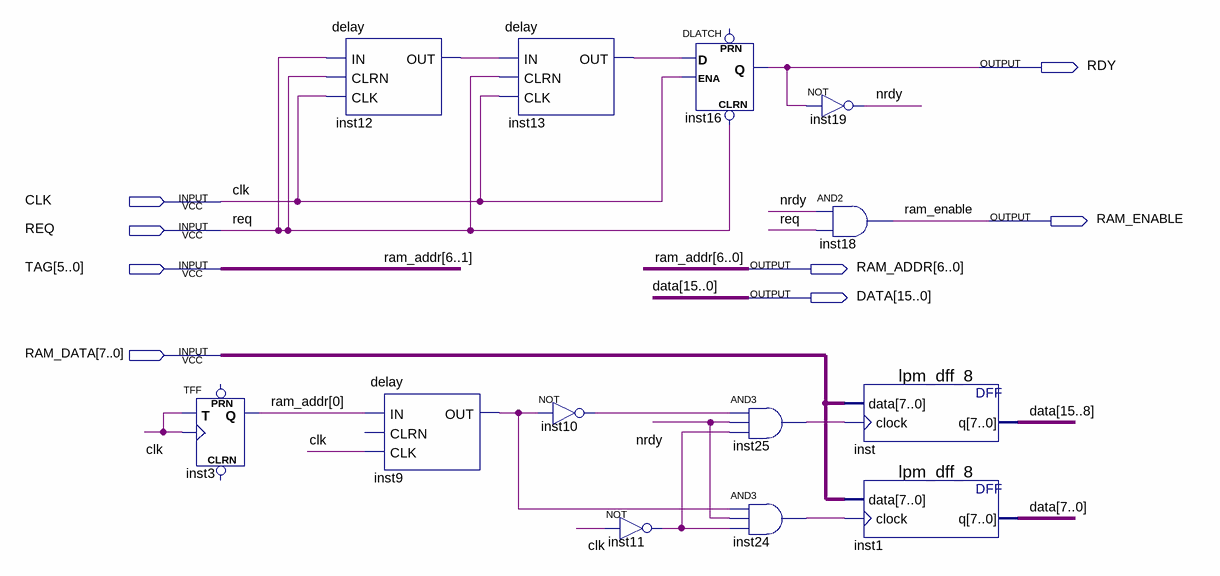
[diagram p0: schematic sheet]
// Quartus schematic device-tag-puller.bdf as structural Verilog: 13 symbols, 8 pins
module \device-tag-puller  (
  input  CLK,
  input  REQ,
  input  [5:0] TAG,
  input  [7:0] RAM_DATA,
  output RDY,
  output RAM_ENABLE,
  output [6:0] RAM_ADDR,
  output [15:0] DATA
);

  wire inst9_out, inst10_out, inst11_out, inst12_out, inst13_out, inst24_out, inst25_out, nrdy;

  TFF inst3 (.T(CLK), .CLK(CLK), .Q(RAM_ADDR[0]));  // open: PRN, CLRN
  delay inst12 (.IN(REQ), .CLRN(REQ), .CLK(CLK), .OUT(inst12_out));
  delay inst9 (.IN(RAM_ADDR[0]), .CLK(CLK), .OUT(inst9_out));  // open: CLRN
  delay inst13 (.IN(inst12_out), .CLRN(REQ), .CLK(CLK), .OUT(inst13_out));
  not inst10 (inst10_out, inst9_out);
  not inst11 (inst11_out, CLK);
  DLATCH inst16 (.CLRN(REQ), .D(inst13_out), .ENA(CLK), .Q(RDY));  // open: PRN
  and inst25 (inst25_out, inst10_out, nrdy, inst11_out);
  and inst24 (inst24_out, inst9_out, nrdy, inst11_out);
  not inst19 (nrdy, RDY);
  and inst18 (RAM_ENABLE, nrdy, REQ);
  lpm_dff_8 inst (.data(RAM_DATA), .clock(inst25_out), .q(DATA[15:8]));
  lpm_dff_8 inst1 (.data(RAM_DATA), .clock(inst24_out), .q(DATA[7:0]));

  assign RAM_ADDR[6:1] = TAG;
endmodule
